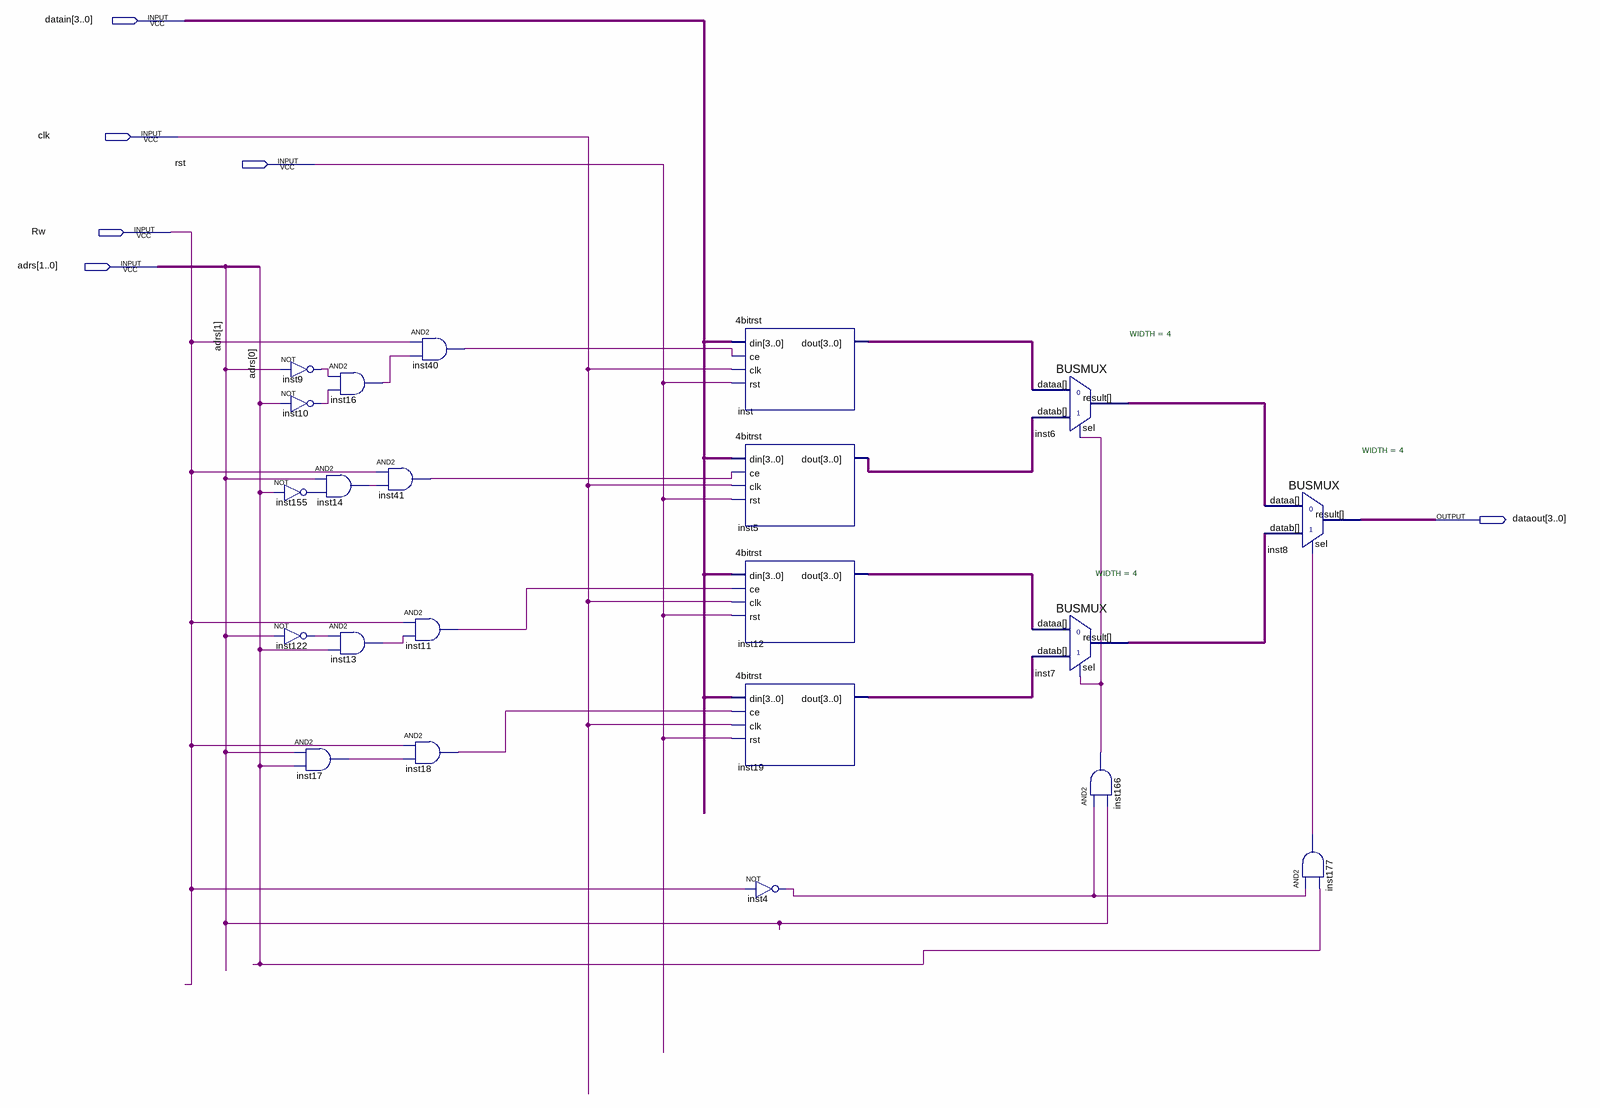
[diagram p0: schematic sheet]
// Quartus schematic fiveweek_ex2.bdf as structural Verilog: 22 symbols, 6 pins
module fiveweek_ex2 (
  input  [3:0] datain,
  input  clk,
  input  rst,
  input  Rw,
  input  [1:0] adrs,
  output [3:0] dataout
);

  wire inst4_out, inst9_out, inst10_out, inst11_out, inst13_out, inst14_out, inst16_out, inst17_out,
       inst18_out, inst40_out, inst41_out, inst122_out, inst155_out, inst166_out, inst177_out;
  wire [3:0] inst5_dout, inst6_result, inst7_result, inst12_dout, inst19_dout, inst_dout;

  not inst9 (inst9_out, adrs[1]);
  not inst10 (inst10_out, adrs[0]);
  not inst155 (inst155_out, adrs[0]);
  not inst122 (inst122_out, adrs[1]);
  and inst16 (inst16_out, inst9_out, inst10_out);
  and inst14 (inst14_out, adrs[1], inst155_out);
  and inst13 (inst13_out, inst122_out, adrs[0]);
  and inst17 (inst17_out, adrs[1], adrs[0]);
  and inst41 (inst41_out, Rw, inst14_out);
  and inst40 (inst40_out, Rw, inst16_out);
  and inst11 (inst11_out, Rw, inst13_out);
  and inst18 (inst18_out, Rw, inst17_out);
  \4bitrst  inst (.din(datain), .ce(inst40_out), .clk(clk), .rst(rst), .dout(inst_dout));
  \4bitrst  inst5 (.din(datain), .ce(inst41_out), .clk(clk), .rst(rst), .dout(inst5_dout));
  \4bitrst  inst12 (.din(datain), .ce(inst11_out), .clk(clk), .rst(rst), .dout(inst12_dout));
  \4bitrst  inst19 (.din(datain), .ce(inst18_out), .clk(clk), .rst(rst), .dout(inst19_dout));
  not inst4 (inst4_out, Rw);
  BUSMUX #(.WIDTH(4)) inst6 (.datab(inst5_dout), .sel(inst166_out), .dataa(inst_dout), .result(inst6_result));
  BUSMUX #(.WIDTH(4)) inst7 (.datab(inst19_dout), .sel(inst166_out), .dataa(inst12_dout), .result(inst7_result));
  and inst166 (inst166_out, inst4_out, adrs[1]);
  BUSMUX #(.WIDTH(4)) inst8 (.datab(inst7_result), .sel(inst177_out), .dataa(inst6_result), .result(dataout));
  and inst177 (inst177_out, inst4_out, adrs[0]);
endmodule
